# Altium schematic sheet CKS32F103C8T6 MCU.SchDoc
size A4; SheetNumber: 4; SheetTotal: 12
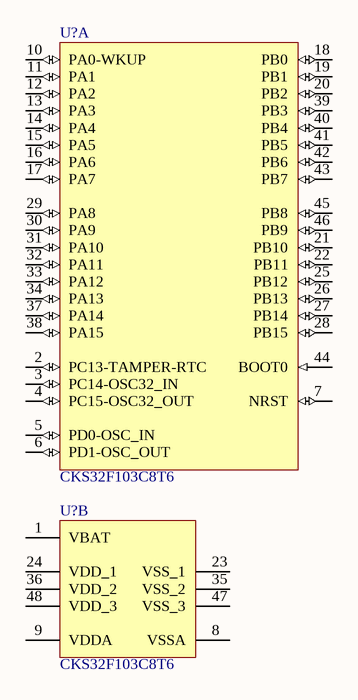
[diagram p0: CKS32F103C8T6 MCU.SchDoc]

## Parts
(Parts that share a designator on the sheet are numbered #1, #2 ... from top to bottom, then left to right.)
U?#1  CKS32F103C8T6  [TSQFP50P900X900X160-48N]  (part A of 2)
U?#2  CKS32F103C8T6  [TSQFP50P900X900X160-48N]  (part B of 2)

## Nets

Not connected (* = marked no-connect by the designer): U?#1 2(PC13-TAMPER-RTC) 3(PC14-OSC32_IN) 4(PC15-OSC32_OUT) 5(PD0-OSC_IN) 6(PD1-OSC_OUT) 7(NRST) 10(PA0-WKUP) 11(PA1) 12(PA2) 13(PA3) 14(PA4) 15(PA5) 16(PA6) 17(PA7) 18(PB0) 19(PB1) 20(PB2) 21(PB10) 22(PB11) 25(PB12) 26(PB13) 27(PB14) 28(PB15) 29(PA8) 30(PA9) 31(PA10) 32(PA11) 33(PA12) 34(PA13) 37(PA14) 38(PA15) 39(PB3) 40(PB4) 41(PB5) 42(PB6) 43(PB7) 44(BOOT0) 45(PB8) 46(PB9); U?#2 1(VBAT) 8(VSSA) 9(VDDA) 23(VSS_1) 24(VDD_1) 35(VSS_2) 36(VDD_2) 47(VSS_3) 48(VDD_3)

## Library data of the parts
U?#1 U?#2 = CKS32F103C8T6: ARM Cortex-M3 32-bit MCU, 64 KB Flash, 20 KB Internal RAM, 37 I/Os, 48-pin LQFP, -40 to 85 degC, Tray; Manufacturer: CKS; Part Number: CKS32F103C8T6; ComponentLink1URL: https://datasheet.lcsc.com/lcsc/2005271105_CKS-CKS32F103C8T6_C556576.pdf; ComponentLink1Description: Datasheet; Package: LQFP-48; Part Status: Active